# EAGLE design Headlightsv4.1 (EAGLE 7.6.0)
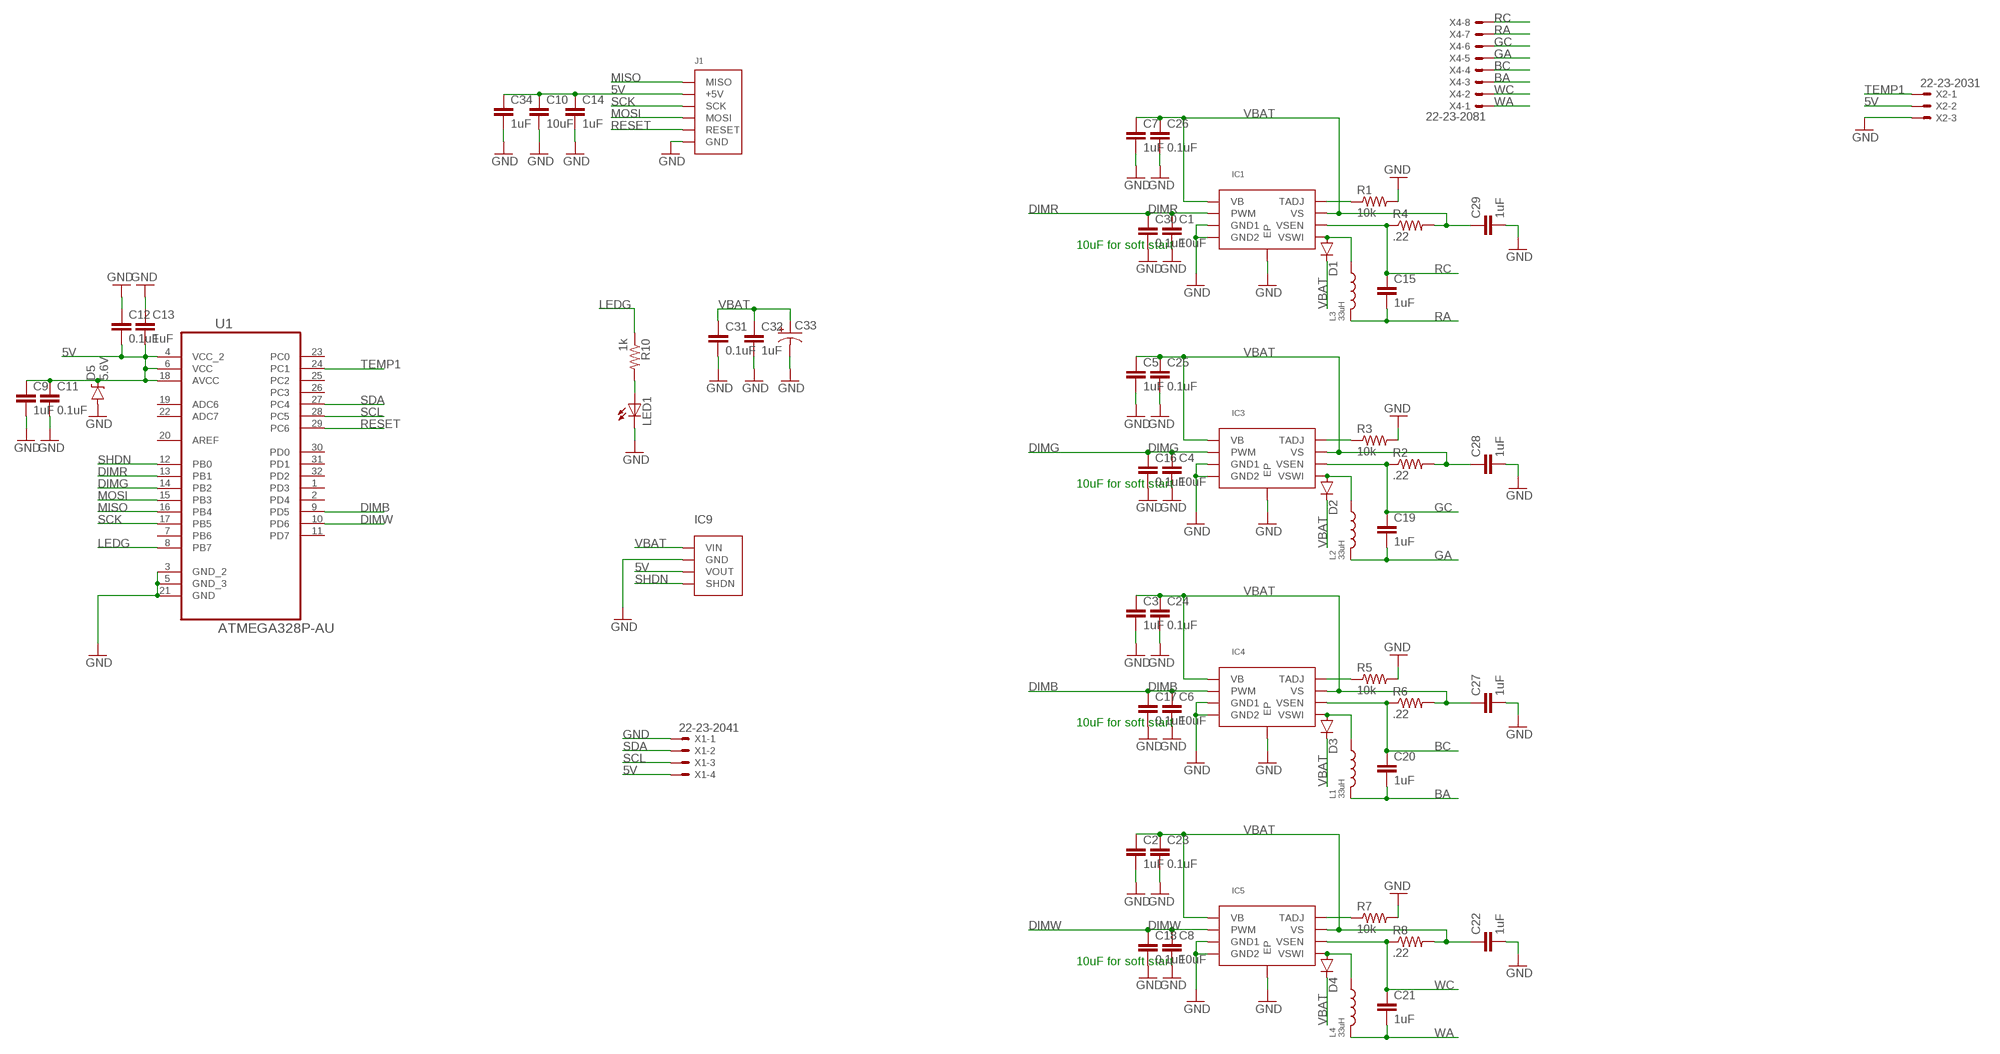
[diagram p0: schematic, sheet 1]

## Parts
C1  10uF  10UF10V10%(0805)  [0805-CAP]
C2  1uF  0.33UF-50V-10%(0805)  [0805-CAP]
C3  1uF  0.33UF-50V-10%(0805)  [0805-CAP]
C4  10uF  10UF10V10%(0805)  [0805-CAP]
C5  1uF  0.33UF-50V-10%(0805)  [0805-CAP]
C6  10uF  10UF10V10%(0805)  [0805-CAP]
C7  1uF  0.33UF-50V-10%(0805)  [0805-CAP]
C8  10uF  10UF10V10%(0805)  [0805-CAP]
C9  1uF  0.33UF-50V-10%(0805)  [0805-CAP]
C10  10uF  10UF10V10%(0805)  [0805-CAP]
C11  0.1uF  0.33UF-50V-10%(0805)  [0805-CAP]
C12  0.1uF  0.33UF-50V-10%(0805)  [0805-CAP]
C13  1uF  0.33UF-50V-10%(0805)  [0805-CAP]
C14  1uF  0.33UF-50V-10%(0805)  [0805-CAP]
C15  1uF  0.33UF-50V-10%(0805)  [0805-CAP]
C16  0.1uF  0.33UF-50V-10%(0805)  [0805-CAP]
C17  0.1uF  0.33UF-50V-10%(0805)  [0805-CAP]
C18  0.1uF  0.33UF-50V-10%(0805)  [0805-CAP]
C19  1uF  0.33UF-50V-10%(0805)  [0805-CAP]
C20  1uF  0.33UF-50V-10%(0805)  [0805-CAP]
C21  1uF  0.33UF-50V-10%(0805)  [0805-CAP]
C22  1uF  0.33UF-50V-10%(0805)  [0805-CAP]
C23  0.1uF  0.33UF-50V-10%(0805)  [0805-CAP]
C24  0.1uF  0.33UF-50V-10%(0805)  [0805-CAP]
C25  0.1uF  0.33UF-50V-10%(0805)  [0805-CAP]
C26  0.1uF  0.33UF-50V-10%(0805)  [0805-CAP]
C27  1uF  0.33UF-50V-10%(0805)  [0805-CAP]
C28  1uF  0.33UF-50V-10%(0805)  [0805-CAP]
C29  1uF  0.33UF-50V-10%(0805)  [0805-CAP]
C30  0.1uF  0.33UF-50V-10%(0805)  [0805-CAP]
C31  0.1uF  0.33UF-50V-10%(0805)  [0805-CAP]
C32  1uF  0.33UF-50V-10%(0805)  [0805-CAP]
C33  CAP_POLF80  [NIPPON_F80]
C34  1uF  0.33UF-50V-10%(0805)  [0805-CAP]
D1  DIODESMA-ALT  [SMA-DIODE_ALT]
D2  DIODESMA-ALT  [SMA-DIODE_ALT]
D3  DIODESMA-ALT  [SMA-DIODE_ALT]
D4  DIODESMA-ALT  [SMA-DIODE_ALT]
D5  5.6V  DIODE-ZENER5.6V  [SOD-323]
IC1  ILD6150_LED_DRIVER  [PG-DSO-8-27]
IC3  ILD6150_LED_DRIVER  [PG-DSO-8-27]
IC4  ILD6150_LED_DRIVER  [PG-DSO-8-27]
IC5  ILD6150_LED_DRIVER  [PG-DSO-8-27]
IC9  5VBUCK_DANNY_CUSTOM_PCB  [4PIN_.1']
J1  ISPHEADER  [2X3PIN_.1']
L1  33uH  CHIP_IND  [8X8MM_IND]
L2  33uH  CHIP_IND  [8X8MM_IND]
L3  33uH  CHIP_IND  [8X8MM_IND]
L4  33uH  CHIP_IND  [8X8MM_IND]
LED1  LEDCHIPLED_0805  [CHIPLED_0805]
R1  10k  0.3OHM-1/8W-1%(0805)  [0805]
R2  .22  RESISTOR1206  [1206]
R3  10k  0.3OHM-1/8W-1%(0805)  [0805]
R4  .22  RESISTOR1206  [1206]
R5  10k  0.3OHM-1/8W-1%(0805)  [0805]
R6  .22  RESISTOR1206  [1206]
R7  10k  0.3OHM-1/8W-1%(0805)  [0805]
R8  .22  RESISTOR1206  [1206]
R10  1k  0.3OHM-1/8W-1%(0805)  [0805]
U1  ATMEGA328P-AU  [QFP80P900X900X120-32N]
X1  22-23-2041  [22-23-2041]
X2  22-23-2031  [22-23-2031]
X4  22-23-2081  [22-23-2081]

## Nets
5V: C9.1 C10.1 C11.1 C12.2 C13.2 C14.1 C34.1 D5.C IC9.P$3(VOUT) J1.P$2(+5V) U1.4(VCC_2) U1.6(VCC) U1.18(AVCC) X1.4 X2.2
BA: C20.2 L1.P$1 X4.3
BC: C20.1 IC4.P$6(VSEN) R6.1 X4.4
DIMB: C6.1 C17.1 IC4.P$2(PWM) U1.9(PD5)
DIMG: C4.1 C16.1 IC3.P$2(PWM) U1.14(PB2)
DIMR: C1.1 C30.1 IC1.P$2(PWM) U1.13(PB1)
DIMW: C8.1 C18.1 IC5.P$2(PWM) U1.10(PD6)
GA: C19.2 L2.P$1 X4.5
GC: C19.1 IC3.P$6(VSEN) R2.1 X4.6
GND: C1.2 C2.2 C3.2 C4.2 C5.2 C6.2 C7.2 C8.2 C9.2 C10.2 C11.2 C12.1 C13.1 C14.2 C16.2 C17.2 C18.2 C22.2 C23.2 C24.2 C25.2 C26.2 C27.2 C28.2 C29.2 C30.2 C31.2 C32.2 C33.- C34.2 D5.A IC1.P$3(GND1) IC1.P$4(GND2) IC1.P$9(EP) IC3.P$3(GND1) IC3.P$4(GND2) IC3.P$9(EP) IC4.P$3(GND1) IC4.P$4(GND2) IC4.P$9(EP) IC5.P$3(GND1) IC5.P$4(GND2) IC5.P$9(EP) IC9.P$2(GND) J1.P$6(GND) LED1.C R1.2 R3.2 R5.2 R7.2 U1.3(GND_2) U1.5(GND_3) U1.21(GND) X1.1 X2.3
LEDG: R10.1 U1.8(PB7)
MISO: J1.P$1(MISO) U1.16(PB4)
MOSI: J1.P$4(MOSI) U1.15(PB3)
N$1: IC1.P$8(TADJ) R1.1
N$2: IC3.P$8(TADJ) R3.1
N$3: D2.A IC3.P$5(VSWI) L2.P$2
N$4: IC4.P$8(TADJ) R5.1
N$5: D1.A IC1.P$5(VSWI) L3.P$2
N$6: D3.A IC4.P$5(VSWI) L1.P$2
N$7: IC5.P$8(TADJ) R7.1
N$8: D4.A IC5.P$5(VSWI) L4.P$2
N$19: LED1.A R10.2
RA: C15.2 L3.P$1 X4.7
RC: C15.1 IC1.P$6(VSEN) R4.1 X4.8
RESET: J1.P$5(RESET) U1.29(PC6)
SCK: J1.P$3(SCK) U1.17(PB5)
SCL: U1.28(PC5) X1.3
SDA: U1.27(PC4) X1.2
SHDN: IC9.P$4(SHDN) U1.12(PB0)
TEMP1: U1.24(PC1) X2.1
VBAT: C2.1 C3.1 C5.1 C7.1 C22.1 C23.1 C24.1 C25.1 C26.1 C27.1 C28.1 C29.1 C31.1 C32.1 C33.+ D1.C D2.C D3.C D4.C IC1.P$1(VB) IC1.P$7(VS) IC3.P$1(VB) IC3.P$7(VS) IC4.P$1(VB) IC4.P$7(VS) IC5.P$1(VB) IC5.P$7(VS) IC9.P$1(VIN) R2.2 R4.2 R6.2 R8.2
WA: C21.2 L4.P$1 X4.1
WC: C21.1 IC5.P$6(VSEN) R8.1 X4.2
Unconnected: U1.1(PD3) U1.2(PD4) U1.7(PB6) U1.11(PD7) U1.19(ADC6) U1.20(AREF) U1.22(ADC7) U1.23(PC0) U1.25(PC2) U1.26(PC3) U1.30(PD0) U1.31(PD1) U1.32(PD2)

## Notes on the sheet
- 10uF for soft start
- 10uF for soft start
- 10uF for soft start
- 10uF for soft start

## Library data of the parts
C1 C4 C6 C8 C10 = SparkFun-Capacitors:10UF10V10%(0805): CAP-11330; PROD_ID: CAP-11330
C2 C3 C5 C7 C9 C11-C32 C34 = SparkFun-Capacitors:0.33UF-50V-10%(0805): CAP-08469; PROD_ID: CAP-08469; VALUE: 0.33uF
C33 = SparkFun-Capacitors:CAP_POL: Capacitor Polarized These are standard SMD and PTH capacitors. Normally 10uF, 47uF, and 100uF in electrolytic and tantalum varieties. Always verify the external diameter of the through hole cap, it varies with capacity, voltage, and manufacturer. The EIA devices should be standard.
D1-D4 = SparkFun-DiscreteSemi:DIODE: Diode These are standard reverse protection diodes and small signal diodes. SMA package can handle up to about 1A. SOD-323 can handle about 200mA. What the SOD-323 package when ordering, there are some mfgs out there that are 5-pin packages.
D5 = SparkFun-DiscreteSemi:DIODE-ZENER: Zener Diode Production Part - 8199 3.4V Zener Voltage; PROD_ID: DIO-12442
IC1 IC3-IC5 = lolomolo:ILD6150_LED_DRIVER
IC9 = lolomolo:5VBUCK_DANNY_CUSTOM_PCB
J1 = lolomolo:ISPHEADER
L1-L4 = lolomolo:CHIP_IND: Chip Inductor
LED1 = adafruit:LED: LED OSRAM: - CHIPLED LG R971, LG N971, LY N971, LG Q971, LY Q971, LO R971, LY R971 LH N974, LH R974 LS Q976, LO Q976, LY Q976 LO Q996 - Hyper CHIPLED LW Q18S LB Q993, LB Q99A, LB R99A - SideLED LS A670, LO A670, LY A670, LG A670, LP A670 LB A673, LV A673, LT A673, LW A673 LH A674 LY A675 LS A676, LA A676, LO A676, LY A676, LW A676 LS A679, LY A679, LG A679 - Hyper Micro SIDELED® LS Y876, LA Y876, LO Y876, LY Y876 LT Y87S - SmartLED LW L88C, LW L88S LB L89C, LB L89S, LG L890 LS L89K, LO L89K, LY L89K LS L896, LA L896, LO L896, LY L896 - TOPLED LS T670, LO T670, LY T670, LG T670, LP T670 LSG T670, LSP T670, LSY T670, LOP T670, LYG T670 LG T671, LOG T671, LSG T671 LB T673, LV T673, LT T673, LW T673 LH T674 LS T676, LA T676, LO T676, LY T676, LB T676, LH T676, LSB T676, LW T676 LB T67C, LV T67C, LT T67C, LS T67K, LO T67K, LY T67K, LW E67C LS E67B, LA E67B, LO E67B, LY E67B, LB E67C, LV E67C, LT E67C LW T67C LS T679, LY T679, LG T679 LS T770, LO T770, LY T770, LG T770, LP T770 LB T773, LV T773, LT T773, LW T773 LH T774 LS E675, LA E675, LY E675, LS T675 LS T776, LA T776, LO T776, LY T776, LB T776 LHGB T686 LT T68C, LB T68C - Hyper Mini TOPLED® LB M676 - Mini TOPLED Santana® LG M470 LS M47K, LO M47K, LY M47K Source: http://www.osram.convergy.de/
R1 R3 R5 R7 R10 = SparkFun-Resistors:0.3OHM-1/8W-1%(0805): RES-11622; PROD_ID: RES-11622; VALUE: 0.3
R2 R4 R6 R8 = SparkFun-Passives:RESISTOR: Resistor Basic schematic elements and footprints for 0603, 1206, and PTH resistors.
U1 = Atmel_By_element14_Batch_1-00:ATMEGA328P-AU: 8-bit Microcontroller with In-System Programmable Flash; MPN: ATMEGA328P-AU; OC_FARNELL: 1715486; OC_NEWARK: 14R4631; PACKAGE: TQFP-32; SUPPLIER: Atmel
X1 = con-molex:22-23-2041: .100" (2.54mm) Center Header - 4 Pin; MF: MOLEX; MPN: 22-23-2041; OC_FARNELL: 1462920; OC_NEWARK: 38C0355
X2 = con-molex:22-23-2031: .100" (2.54mm) Center Header - 3 Pin; MF: MOLEX; MPN: 22-23-2031; OC_FARNELL: 1462950; OC_NEWARK: 30C0862
X4 = con-molex:22-23-2081: .100" (2.54mm) Center Header - 8 Pin; MF: MOLEX; MPN: 22-23-2081; OC_FARNELL: 1756826; OC_NEWARK: 01C7592

## Board
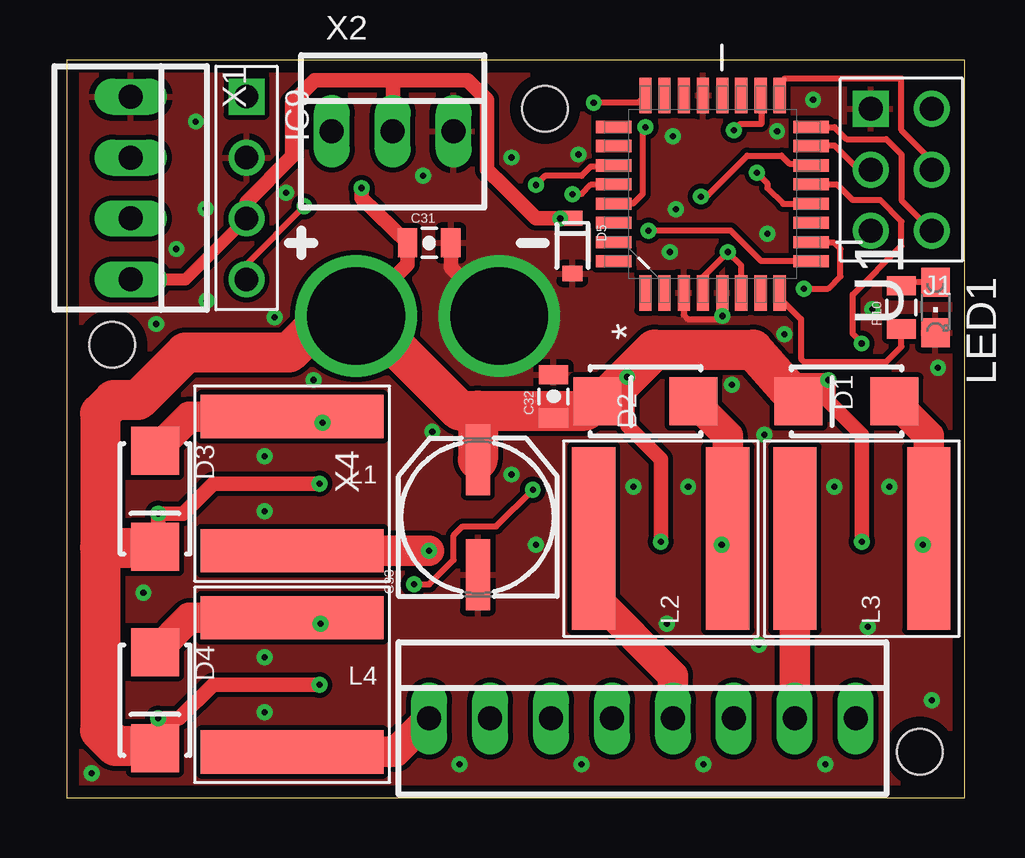
[diagram p1: board, top side]
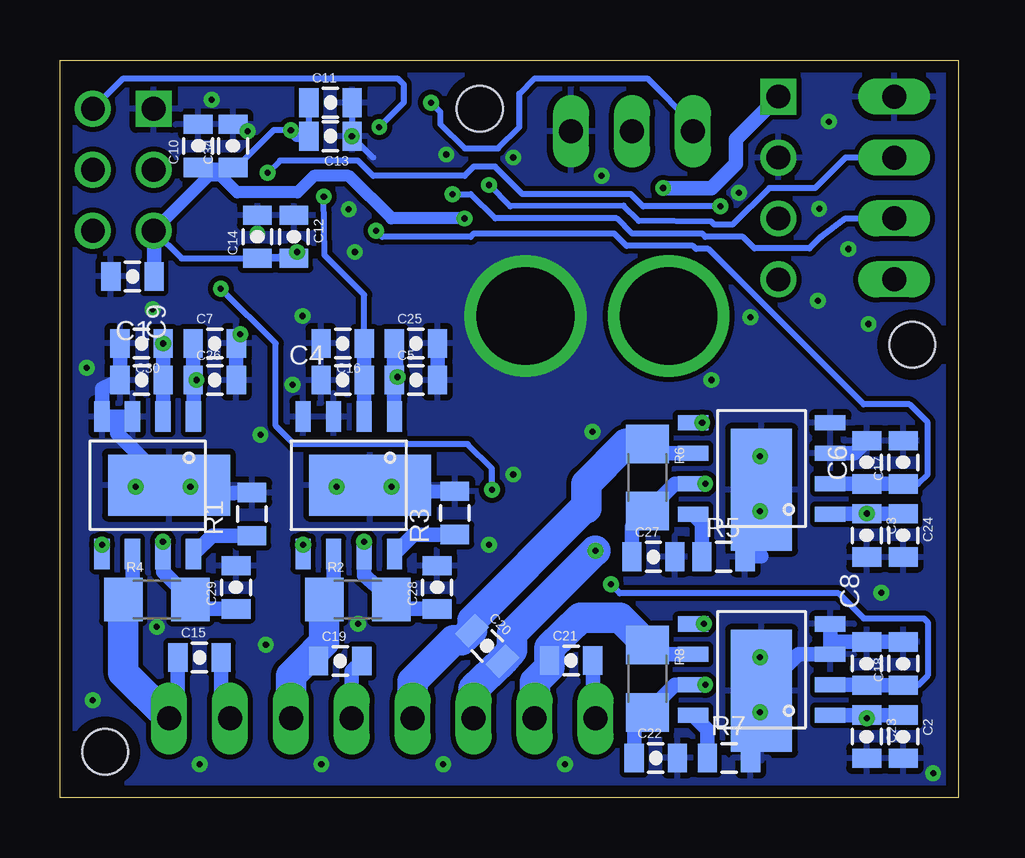
[diagram p2: board, bottom side, seen from below]

Size 37.44 x 30.73 mm. Coordinates in mm from the lower left corner, seen from the top.
Outline: 0,0 37.44,0 37.44,30.73 0,30.73 0,0
Copper layers (1*16): Top 0.035mm / dielectric 1.5mm / Bottom 0.035mm
Design rules "PCBWAY": minimum track width 10mil, minimum drill 10mil, track to track 8mil, track to pad 8mil, pad to pad 8mil, via to via 8mil, smd to smd 8mil, copper to edge 20mil, drill to drill 8mil, minimum pad ring 10mil, minimum via ring 8mil, stop-mask expansion 4mil, vias tented up to drill 0mil, thermal gap 10mil
Holes 1.91 mm at 35.56,1.91 1.91,18.87 19.94,28.7

### Footprints (pad centres in the part's own frame; a part is rotated, then mirrored left to right if it is on the bottom)
0805-CAP = smd 0.8 x 1.2: 1 -0.9,0; 2 0.9,0
NIPPON_F80 = smd 2.95 x 1: + 2.4,0; - -2.4,0
SMA-DIODE_ALT = smd 2 x 2: A -2,0; C 2,0
SOD-323 = smd 0.63 x 0.83: A 1.15,0; C -1.15,0
PG-DSO-8-27 = smd 0.635 x 1.27: P$1 0,0; P$2 1.27,0; P$3 2.54,0; P$4 3.81,0; P$5 3.81,5.715; P$6 2.54,5.715; P$7 1.27,5.715; P$8 0,5.715 | smd 5.08 x 2.54: P$9 1.016,2.857
4PIN_.1' = drill 0.991 square: P$1 -3.81,0 | drill 0.991: P$2 -1.27,0; P$3 1.27,0; P$4 3.81,0
2X3PIN_.1' = drill 0.991: P$1 -1.27,1.27; P$2 1.27,1.27; P$3 -1.27,-1.27; P$4 1.27,-1.27; P$5 -1.27,-3.81 | drill 0.991 square: P$6 1.27,-3.81
8X8MM_IND = smd 1.803 x 7.62: P$1 -2.794,0; P$2 2.794,0
CHIPLED_0805 = smd 1.2 x 1.2: A 0,-1.05; C 0,1.05
0805 = smd 0.8 x 1.2: 1 -0.9,0; 2 0.9,0
1206 = smd 1.6 x 1.8: 1 -1.4,0; 2 1.4,0
QFP80P900X900X120-32N = smd 1.473 x 0.508: 1 -4.115,2.794; 2 -4.115,2.007; 3 -4.115,1.194; 4 -4.115,0.406; 5 -4.115,-0.406; 6 -4.115,-1.194; 7 -4.115,-2.007; 8 -4.115,-2.794; 17 4.115,-2.794; 18 4.115,-2.007; 19 4.115,-1.194; 20 4.115,-0.406; 21 4.115,0.406; 22 4.115,1.194; 23 4.115,2.007; 24 4.115,2.794 | smd 0.508 x 1.473: 9 -2.794,-4.115; 10 -2.007,-4.115; 11 -1.194,-4.115; 12 -0.406,-4.115; 13 0.406,-4.115; 14 1.194,-4.115; 15 2.007,-4.115; 16 2.794,-4.115; 25 2.794,4.115; 26 2.007,4.115; 27 1.194,4.115; 28 0.406,4.115; 29 -0.406,4.115; 30 -1.194,4.115; 31 -2.007,4.115; 32 -2.794,4.115
22-23-2041 = drill 1 long: 1 -3.81,0; 2 -1.27,0; 3 1.27,0; 4 3.81,0
22-23-2031 = drill 1 long: 1 -2.54,0; 2 0,0; 3 2.54,0
22-23-2081 = drill 1 long: 1 -8.89,0; 2 -6.35,0; 3 -3.81,0; 4 -1.27,0; 5 1.27,0; 6 3.81,0; 7 6.35,0; 8 8.89,0

### Placement (x,y rotation side)
C1  34.04,17.4 180 bottom
C2  2.29,2.54 270 bottom
C3  3.81,10.92 270 bottom
C4  25.65,17.4 180 bottom
C5  22.61,17.4 0 bottom
C6  3.81,13.97 90 bottom
C7  30.99,18.92 0 bottom
C8  3.81,5.59 90 bottom
C9  34.42,21.72 180 bottom
C10  31.67,27.15 90 bottom
C11  26.16,28.96 0 bottom
C12  27.69,23.37 270 bottom
C13  26.16,27.56 180 bottom
C14  29.21,23.37 90 bottom
C15  31.62,5.84 0 bottom
C16  25.65,18.92 180 bottom
C17  2.29,13.97 90 bottom
C18  2.29,5.59 90 bottom
C19  25.76,5.69 0 bottom
C20  19.63,6.32 315 bottom
C21  16.13,5.71 0 bottom
C22  12.6,1.65 0 bottom
C23  3.81,2.54 270 bottom
C24  2.29,10.92 270 bottom
C25  22.61,18.92 0 bottom
C26  30.99,17.4 0 bottom
C27  12.7,10.03 0 bottom
C28  21.72,8.76 90 bottom
C29  30.1,8.76 90 bottom
C30  34.04,18.92 180 bottom
C31  15.11,23.11 0 top
C32  20.29,16.71 90 top
C33  17.14,11.68 90 top
C34  30.23,27.15 90 bottom
D1  32.51,16.51 180 top
D2  24.13,16.51 180 top
D3  3.68,12.45 270 top
D4  3.68,4.06 270 top
D5  21.08,22.99 270 top
IC1  31.88,15.88 180 bottom
IC3  23.5,15.88 180 bottom
IC4  5.33,11.81 90 bottom
IC5  5.33,3.43 90 bottom
IC9  7.49,25.4 270 top
J1  34.8,24.89 180 top
L1  9.4,13.08 90 top
L2  24.77,10.79 0 top
L3  33.15,10.79 0 top
L4  9.4,4.7 90 top
LED1  36.22,20.42 180 top
R1  29.44,11.81 90 bottom
R2  25.02,8.26 0 bottom
R3  20.98,11.86 90 bottom
R4  33.4,8.26 0 bottom
R5  9.78,10.03 0 bottom
R6  12.95,13.34 270 bottom
R7  9.55,1.65 0 bottom
R8  12.95,4.95 270 bottom
R10  34.8,20.42 90 top
U1  26.92,25.15 90 top
X1  2.67,25.4 270 top
X2  13.59,27.76 0 top
X4  24,3.3 0 top

### Tracks (layer width: path | path; a pad name or v marks a point on that pad's centre or on a via)
5V  (via drill 0.25)
  Top 0.254: U1.4 26.52,21.69 v27.56,22.73 28.12,22.17 U1.6 | U1.18 28.96,29.23 28.96,28.07 28.07,28.07 v27.81,27.81 | 18.3,25.53 18.22,25.46 | D5.C v20.58,24.14 v20.57,24.13
  Top 0.508: X1.4 4.95,21.59 IC9.P$3
  Top 0.61: v20.57,24.13 19.56,24.13 18.22,25.46 17.53,26.16 17.53,29.08 16.71,29.9 13.61,29.9 | 13.61,29.9 10.34,29.9 9.4,28.96 9.4,26.72 7.49,24.82 IC9.P$3 | X2.2 13.61,29.9
  Bottom 0.254: C13.2 C11.1 | C14.1 C12.2 | v27.56,22.73 27.44,22.61 C14.1 | J1.P$2 32.37,22.47 C14.1 | v27.81,27.81 28.52,27.81 30.28,26.06 30.73,26.04 30.73,25.91
  Bottom 0.406: C10.1 C34.1 30.71,26.25 30.28,26.06
  Bottom 0.508: v20.57,24.13 23.62,24.13 25.4,25.91 26.85,25.91 27.53,25.22 30.05,25.22 30.73,25.91 31.24,25.91 J1.P$2 | C13.2 27.56,27.56 v27.81,27.81
  Bottom 0.61: C9.1 33.52,23.61 J1.P$2
BA  (via drill 0.25)
  Top 1.27: v15.11,10.29 L1.P$1
  Bottom 1.27: v15.11,10.29 15.14,10.29 18.59,6.83 18.59,6.14 C20.2 20.19,4.54 X4.3
BC
  Bottom 0.61: R6.1 12.57,14.35 IC4.P$6
  Bottom 1.27: R6.1 13.84,14.73 15.49,13.08 15.49,12.06 15.6,12.06 20.25,7.39 C20.1 20.7,6.55 21.03,6.55 22.73,4.85 X4.4
DIMB  (via drill 0.25)
  Top 0.254: U1.9 28.96,22.35 27.69,23.62 v24.26,23.62
  Bottom 0.254: v24.26,23.62 24,23.37 20.32,23.37 20.19,23.5 14.33,23.5 13.82,22.99 11.05,22.99 10.92,22.86 10.41,22.86 3.94,16.38 2.02,16.38 1.27,15.63 1.27,13.46 1.66,13.07 C17.1
  Bottom 0.61: IC4.P$2 3.82,13.08 C6.1 C17.1
DIMG  (via drill 0.25)
  Top 0.254: U1.14 30.96,26.42 30.12,26.42 29.79,26.75 28.37,26.75 26.67,25.04 v26.44,25.04
  Bottom 0.254: v26.44,25.04 26.42,22.61 24.75,20.94 C16.1
  Bottom 0.61: IC3.P$2 24.77,17.39 C4.1 C16.1 24.78,18.95
DIMR  (via drill 0.25)
  Top 0.254: U1.13 31.06,25.53 32.13,25.53 32.77,24.89 33.91,24.89 34.8,24 34.8,22.99 32.77,20.95 32.77,19.34 33.16,18.95 C30.1
  Bottom 0.61: IC1.P$2 33.15,17.03 C1.1 C30.1
  other vias: 33.14,18.92
DIMW  (via drill 0.25)
  Top 0.254: v14.48,8.89 15.11,8.89 16.13,9.91 16.13,10.92 16.51,11.3 17.91,11.3 v19.43,12.83 | v30.73,21.21 31.75,21.21 32.26,21.72 32.26,22.86 32,23.11 31.06,23.11 U1.10
  Bottom 0.254: v14.48,8.89 14.1,8.51 4.98,8.51 3.94,7.47 1.42,7.47 1.27,7.32 1.27,5.08 1.66,4.69 C18.1 | v30.73,21.21 28.45,18.92 28.45,15.49 27.69,14.73 20.45,14.73 19.43,13.72 v19.43,12.83
  Bottom 0.61: IC5.P$2 3.82,4.7 C8.1 C18.1
GA
  Top 1.27: X4.5 25.27,5.08 21.97,8.38 L2.P$1
  Bottom 0.61: C19.2 25.27,5.27 X4.5
GC
  Bottom 0.61: R2.1 26.04,8.89 IC3.P$6 | C19.1 27.3,5.6 27.3,5.59
  Bottom 1.27: X4.6 27.81,5.08 27.3,5.59 26.42,6.47 R2.1
GND  (via drill 0.25, 4.06)
  Top 0.254: U1.3 25.73,20.12 25.91,19.94 27.18,19.94 27.3,20.07 27.3,21.01 U1.5
  Top 0.61: C31.2 16.01,22.09 v18.03,20.07
  Bottom 0.254: C11.2 C13.1 | 24.38,26.67 v25.27,27.56
  Bottom 0.508: v29.62,27.76 30.11,27.94 C34.2
  Bottom 0.61: IC1.P$3 35.05,15.88 | 35.05,15.88 IC1.P$4 35.69,17.03 C1.2 C30.2 | C26.2 C7.2 30.09,17.16 30.1,17.14 | R1.2 31.55,12.64 IC1.P$9 35.05,15.18 35.05,15.88 | 29.59,12.7 30.21,12.7 R1.2 | 8.94,10.71 R5.2 | 8.5,4.14 IC5.P$9 6.67,5.97 IC5.P$3 5.33,6.48 | R5.2 8.5,12.52 IC4.P$9 | IC3.P$9 24.19,12.7 22.37,12.75 R3.2 21.1,12.75 | 5.33,6.48 IC5.P$4 | C18.2 C8.2 5.32,6.49 5.33,6.48 | 8.89,10.76 R5.2 | C5.2 C25.2 | 29.62,12.66 R1.2 | IC4.P$3 4.33,14.35 C6.2 | 8.2,10.06 8.46,10.06 | 8.46,10.06 8.46,10.24 | 8.46,10.06 8.48,10.08 8.91,10.08 8.91,10.03 8.89,10.01 8.79,10.01 8.81,10.03 8.84,10.03 8.81,10.06 8.81,10.39
  other vias: 3.73,19.74 10.29,17.4 15.24,15.24 19.56,10.54 18.54,13.46 16.38,1.4 21.46,1.4 26.54,1.4 31.62,1.4 36.07,4.06 29.08,15.11 36.32,17.91 33.58,20.35 25.15,22.73 25.4,24.51 18.54,26.67 31.11,29.08 4.57,22.86 5.84,20.7 23.62,12.95 25.91,12.95 8.26,3.56 34.29,12.95 32,12.95 8.26,5.84 8.26,11.94 8.26,14.22 14.86,25.91 25.02,7.24 33.4,7.11 29.21,23.5 29.92,19.3 27.33,20.07 28.85,6.38 27.74,17.2 21.34,26.8 8.66,20.02 3.2,8.53 1.04,1.02 9.14,25.2 5.38,28.17 5.79,24.54
  pour Bottom: -0.13,30.61 37.34,30.61 37.34,0 -0.13,0
  pour Top: -0.13,0 37.34,0 37.34,30.61 -0.13,30.61
LEDG
  Top 0.254: U1.8 29.72,20.83 30.61,19.94 30.61,18.29 30.73,18.16 34.16,18.16 34.8,18.8 R10.1
MISO
  Top 0.254: J1.P$1 34.8,24.89 34.8,26.8 34.16,27.43 32.51,27.43 32,27.94 U1.16
MOSI
  Top 0.254: U1.15 30.56,27.18 32,27.18 33.02,26.16 J1.P$4
N$1
  Bottom 0.61: IC1.P$8 31.1,10.91 R1.1
N$2
  Bottom 0.61: IC3.P$8 22.69,10.96 R3.1
N$3  (via drill 0.25)
  Top 0.61: v27.3,10.54 27.3,11.56 L2.P$2
  Top 1.27: D2.A 27.56,15.08 L2.P$2
  Bottom 0.61: IC3.P$5 v27.3,10.54
N$4
  Bottom 0.61: R5.1 10.68,11.44 IC4.P$8
N$5  (via drill 0.25)
  Top 0.61: v35.69,10.54 35.69,11.56 L3.P$2
  Top 1.27: D1.A 35.94,15.08 L3.P$2
  Bottom 0.61: IC1.P$5 v35.69,10.54
N$6  (via drill 0.25)
  Top 0.61: v10.67,15.62 9.14,15.62 8.89,15.88
  Top 1.27: D3.A 5.11,15.88 8.89,15.88 L1.P$2
  Bottom 0.61: IC4.P$5 v10.67,15.62
N$7
  Bottom 0.61: R7.1 10.45,2.83 IC5.P$8
N$8  (via drill 0.25)
  Top 0.254: L4.P$2 10.16,7.49 v10.59,7.24
  Top 1.27: D4.A 5.11,7.49 L4.P$2
  Bottom 0.61: v10.59,7.24 IC5.P$5
N$19
  Top 0.254: LED1.A 34.65,21.47 R10.2
RA
  Top 1.27: X4.7 L3.P$1
  Bottom 0.61: C15.2 30.72,3.67 X4.7
RC
  Bottom 0.61: IC1.P$6 34.42,8.77 R4.1 34.67,8.26 34.67,7.24 | C15.1 32.52,3.67 X4.8
  Bottom 1.27: X4.8 34.8,5.21 R4.1
RESET  (via drill 0.25)
  Top 0.254: U1.29 22.84,24.77 23.62,24.77 24,25.15 24,27.81 v24.13,27.94
  Bottom 0.254: J1.P$5 34.8,29.97 23.37,29.97 23.11,29.72 23.11,28.96 v24.13,27.94
SCK
  Top 0.254: J1.P$3 36.07,26.54 34.8,27.81 34.8,29.97 29.92,29.97 U1.17
SCL  (via drill 0.25)
  Top 0.254: U1.28 22.78,25.53 21.84,25.53 21.46,25.15 v21.08,25.15
  Bottom 0.254: v21.08,25.15 20.32,25.15 19.3,24.13 14.22,24.13 13.59,23.5 10.67,23.5 10.54,23.37 8.97,23.37 8.48,22.89 6.2,22.89 5.71,23.37 4.7,24.13 X1.3
SDA  (via drill 0.25)
  Top 0.254: 22.61,26.29 U1.27 22.76,26.29 21.84,26.29 21.46,25.91 19.94,25.91 v19.56,25.53
  Bottom 0.254: X1.2 4.7,26.67 5.97,25.4 7.87,25.4 9.4,23.88 10.16,23.88 10.29,24 13.31,24.03 13.95,24.66 18.67,24.64 v19.56,25.53
SHDN  (via drill 0.25)
  Top 0.254: IC9.P$4 7.49,22.23 v9.91,24.64 | v28.78,26.04 29.21,25.6 29.21,25.4 29.87,24.74 U1.12
  Bottom 0.254: v9.91,24.64 13.13,24.64 13.64,25.15 18.16,25.15 19.3,26.29 20.19,26.29 20.57,25.91 24.38,25.91 25.02,26.54 28.27,26.54 v28.78,26.04
TEMP1  (via drill 0.25)
  Top 0.254: U1.24 23.82,28.96 v21.97,28.96
  Bottom 0.254: v21.97,28.96 21.59,28.57 21.59,28.07 20.57,27.05 19.18,27.05 18.29,27.94 18.29,29.34 17.65,29.97 12.95,29.97 11.05,28.07 X2.1
VBAT  (via drill 0.25, 4.06)
  Top 0.406: C32.1 20.61,16.13 21.46,16.13
  Top 0.61: 31.11,17.02 31.15,17.05 D1.C 30.64,17.4 v31.75,17.4 31.75,16.51 33.15,15.11 v33.15,10.67 | D4.C 3.81,2.19 v3.81,3.3 4.7,3.3 6.1,4.7 v10.54,4.7 | D3.C 3.81,10.57 v3.81,11.84 4.85,11.84 6.1,13.08 v10.54,13.08 | 23.62,17.78 23.62,18.29 v23.37,17.53 23.37,15.49 24.77,14.1 v24.77,10.67 | 12.32,20.32 v12.06,20.07 14.21,22.21 C31.1 12.29,24.98 v12.29,25.4
  Top 1.676: 1.4,10.41 1.4,2.79 2.03,2.16 3.59,2.16 D4.C | 1.4,10.41 1.4,16 1.96,16.56 2.97,16.56 4.95,18.54 9.27,18.54 10.79,20.07 v12.06,20.07 12.45,20.07 16.38,16.13 17.14,16.13 | 1.4,10.41 3.65,10.41 D3.C | 17.14,16.13 21.46,16.13 21.62,16.13 D2.C 22.35,16.51 v23.37,17.53 23.62,17.78 24.51,18.67 28.61,18.67 D1.C | 17.14,16.13 C33.+
  Bottom 0.254: 23.51,18.67 23.43,18.59 | IC3.P$1
  Bottom 0.61: IC1.P$1 C7.1 C26.1 v31.75,17.4 | C29.1 31.61,7.86 R4.2 33.15,9.4 IC1.P$7 v33.15,10.67 | C28.1 23.23,7.86 R2.2 24.77,9.27 IC3.P$7 v24.77,10.67 | C27.1 13.6,11.29 R6.2 11.81,13.08 IC4.P$7 v10.54,13.08 | C22.1 13.5,3.31 R8.2 11.81,4.7 IC5.P$7 v10.54,4.7 | C2.1 C23.1 | C23.1 IC5.P$1 | C24.1 C3.1 | C3.1 5.32,11.82 IC4.P$1 | C23.1 v3.81,3.3 | C3.1 v3.81,11.84 | 23.51,17.64 23.5,17.65 23.51,17.65 | 23.51,17.65 23.51,17.64 | 23.51,17.64 C5.1 IC3.P$1 | 23.51,18.67 23.51,17.65 | C25.1 23.51,18.67 | 23.51,18.67 23.5,18.67 | IC3.P$1 | 23.51,18.67 23.5,18.66 v23.37,17.53 | IC9.P$1 9.27,27.43 9.27,26.42 10.29,25.4 v12.29,25.4
WA
  Top 1.27: X4.1 13.72,1.91 L4.P$1
  Bottom 0.61: C21.2 15.23,3.42 X4.1
WC
  Bottom 0.61: R8.1 12.57,5.97 IC5.P$6
  Bottom 1.27: X4.2 17.63,4.84 17.03,5.44 C21.1 17.03,6.24 15.75,7.49 14.09,7.49 R8.1